# EAGLE design Nixie_power_supply_v1.0.2 (EAGLE 6.5.0)
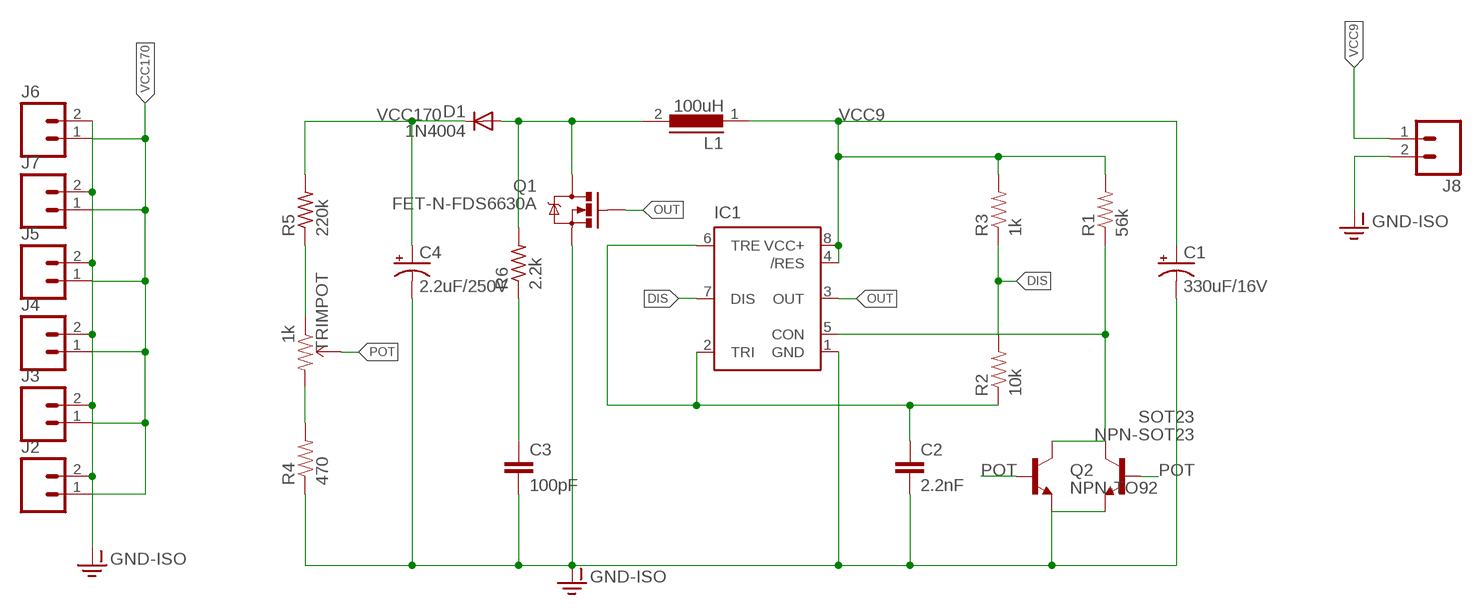
[diagram p0: schematic, sheet 1]

## Parts
C1  330uF/16V  CPOL-USE3.5-8  [E3,5-8]
C2  2.2nF  CAP0805  [0805]
C3  100pF  C-EUC1005  [C1005]
C4  2.2uF/250V  CAP_POLPTH1  [CPOL-RADIAL-100UF-25V]
D1  1N4004  [DO41-10]
IC1  NE555D  [SO08]
J2  M02LOCK  [1X02_LOCK]
J3  M02LOCK  [1X02_LOCK]
J4  M02LOCK  [1X02_LOCK]
J5  M02LOCK  [1X02_LOCK]
J6  M02LOCK  [1X02_LOCK]
J7  M02LOCK  [1X02_LOCK]
J8  M02LOCK  [1X02_LOCK]
L1  100uH  DR74  [DR74]
Q1  FET-N-FDS6630A  MOSFET-NCHANNELFDS6630A  [SO08]
Q2  NPN-TO92  TRANSISTOR_NPNBC547  [TO-92-AMMO]
R1  56k  RESISTOR0805-RES  [0805]
R2  10k  RESISTOR0805-RES  [0805]
R3  1k  RESISTOR0805-RES  [0805]
R4  470  RESISTOR0805-RES  [0805]
R5  220k  R-US_R1206  [R1206]
R6  2.2k  R-US_R1206  [R1206]
SOT23  NPN-SOT23  BC817-16-NPN-SOT23-BEC  [SOT23-BEC]
TRIMPOT  1k  TRIMPOT-2  [TRIMPOT_TC33]

## Nets
C2: C2.1 IC1.2(TRI) IC1.6(TRE) R2.1
DIS: IC1.7(DIS) R2.2 R3.1
GND-ISO: C1.- C2.2 C3.2 C4.2(-) IC1.1(GND) J2.2 J3.2 J4.2 J5.2 J6.2 J7.2 J8.2 Q1.1(S) Q1.2(S) Q1.3(S) Q2.3(E) R4.1 SOT23.E
N$1: D1.A L1.2 Q1.5(D) Q1.6(D) Q1.7(D) Q1.8(D) R6.2
N$4: C3.1 R6.1
N$6: R5.1 TRIMPOT.1(CCW)
N$7: R4.2 TRIMPOT.3(CW)
N$11: IC1.5(CON) Q2.1(C) R1.1 SOT23.C
OUT: IC1.3(OUT) Q1.4(G)
POT: Q2.2(B) SOT23.B TRIMPOT.2(WIPER)
VCC9: C1.+ IC1.4(/RES) IC1.8(VCC+) J8.1 L1.1 R1.2 R3.2
VCC170: C4.1(+) D1.C J2.1 J3.1 J4.1 J5.1 J6.1 J7.1 R5.2

## Library data of the parts
C1 = resistor:CPOL-US: POLARIZED CAPACITOR, American symbol
C2 = SparkFun-Passives:CAP: Capacitor Standard 0603 ceramic capacitor, and 0.1" leaded capacitor.
C3 = resistor:C-EU: CAPACITOR, European symbol
C4 = SparkFun-Passives:CAP_POL: Capacitor Polarized These are standard SMD and PTH capacitors. Normally 10uF, 47uF, and 100uF in electrolytic and tantalum varieties. Always verify the external diameter of the through hole cap, it varies with capacity, voltage, and manufacturer. The EIA devices should be standard.
D1 = diode:1N4004: DIODE general purpose rectifier, 1 A
IC1 = SparkFun-AnalogIC:NE555: General purpose bipolar Timer
J2-J8 = SparkFun-Connectors:M02: Standard 2-pin 0.1" header. Use with - straight break away headers ( PRT-00116) - right angle break away headers (PRT-00553) - swiss pins (PRT-00743) - machine pins (PRT-00117) - female headers (PRT-00115) Molex polarized connector foot print use with: PRT-08233 with associated crimp pins and housings. 2.54_SCREWTERM for use with PRT-10571. 3.5mm Screw Terminal footprints for PRT-08084 5mm Screw Terminal footprints for use with PRT-08432
L1 = inductors:DR74: High Power Density, High Efficiency, Shielded Inductors Source: coiltronics_dr_series.pdf
Q1 = SparkFun-DiscreteSemi:MOSFET-NCHANNEL: Common NMOSFET Parts MFG P/N Store ID Prod ID FDD8780 TRANS-09984 SI7820DN TRANS-11055 FDS6630A IC-08089 2N7002PW TRANS-11151 FQP30N06L COM-10213 TRANS-10060 BSS123LT1G TRANS-08345 BSS138 TRANS-00830 BS170 2N7000; PROD_ID: IC-08089
Q2 = SparkFun-DiscreteSemi:TRANSISTOR_NPN: Generic NPN BJT MMBT2222A - TRANS-08049 (SOT-23, 1A 40V) MPSA42 - TRANS-09116 (SOT-23, 500mA 300V) MMBT5088LT1G - TRANS-11160 (SOT-23, 50 mA 30V) BC547 - COM-08928 <http://www.sparkfun.com/products/8928> (TO-92 45V 100mA) (1.Collector 2.Base 3.Emitter) 2N3904 - COM-00521 <http://www.sparkfun.com/products/521> (TO-92 40V 200mA) (1.Emitter 2.Base 3.Collector) P2N2222A - COM-12852 <http://www.sparkfun.com/products/12852> (TO-92 40V 600mA) (1.Collector 2.Base 3.Emitter)
R1-R4 = SparkFun-Passives:RESISTOR: Resistor Basic schematic elements and footprints for 0603, 1206, and PTH resistors.
R5 R6 = rcl:R-US_: RESISTOR, American symbol
SOT23 = transistor:*-NPN-: NPN Transistror BF959 corrected 2008.03.06
TRIMPOT = SparkFun-Electromechanical:TRIMPOT: Various small potentiometers for "set-and-forget" applications

## Board
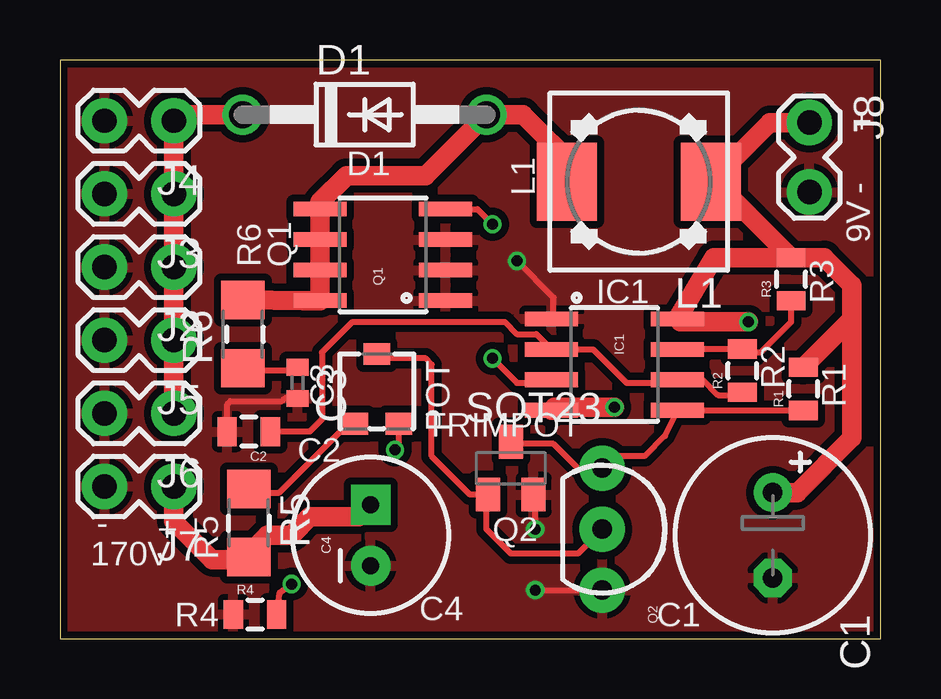
[diagram p1: board, top side]
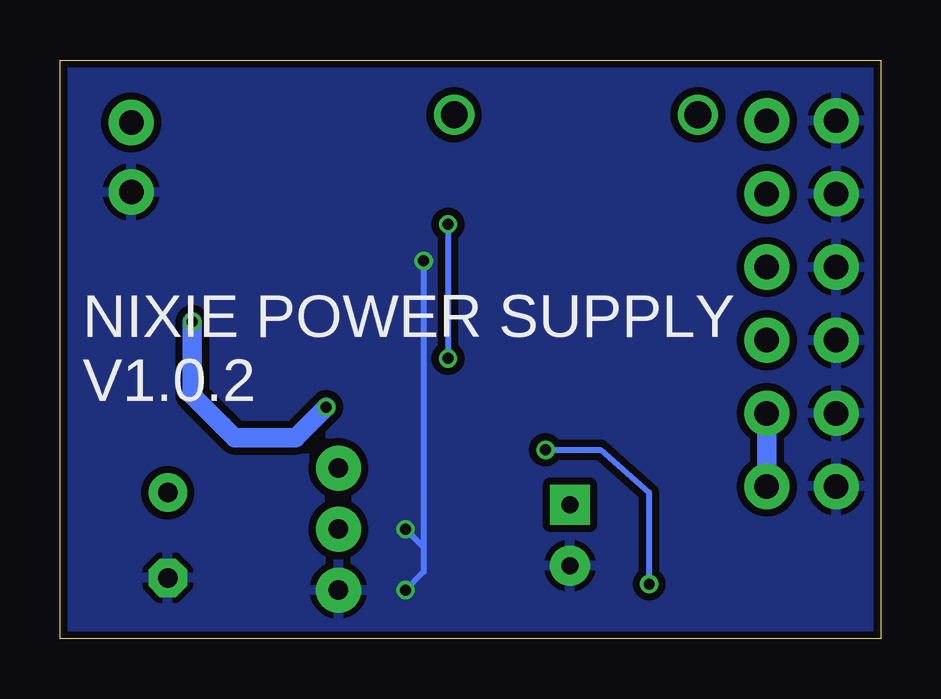
[diagram p2: board, bottom side, seen from below]

Size 34.21 x 24.12 mm. Coordinates in mm from the lower left corner, seen from the top.
Outline: 0,0 34.21,0 34.21,24.12 0,24.12 0,0
Copper layers (1*16): Top 0.035mm / dielectric 1.5mm / Bottom 0.035mm
Design rules "SeeedStudio_2layer_DRU_no_angle_20140221": minimum track width 6mil, minimum drill 12mil, track to track 6mil, track to pad 6mil, pad to pad 6mil, via to via 6mil, smd to smd 0mil, copper to edge 10mil, drill to drill 10mil, minimum pad ring 10mil, minimum via ring 6mil, stop-mask expansion 2mil, vias tented up to drill 100mil, thermal gap 10mil

### Footprints (pad centres in the part's own frame; a part is rotated, then mirrored left to right if it is on the bottom)
E3,5-8 = drill 0.813 pad 1.6: + -1.778,0 | drill 0.813 pad 1.6 octagon: - 1.778,0
0805 = smd 0.8 x 1.2: 1 -0.9,0; 2 0.9,0
C1005 = smd 0.7 x 0.9: 1 -0.65,0; 2 0.65,0
CPOL-RADIAL-100UF-25V = drill 0.7 pad 1.651 square: 1 1.27,0 | drill 0.7 pad 1.651: 2 -1.27,0
DO41-10 = drill 1.118: A 5.08,0; C -5.08,0
SO08 = smd 0.61 x 2.21: 1 -1.905,-2.616; 2 -0.635,-2.616; 3 0.635,-2.616; 4 1.905,-2.616; 5 1.905,2.616; 6 0.635,2.616; 7 -0.635,2.616; 8 -1.905,2.616
1X02_LOCK = drill 1.016 pad 1.88: 1 -0.178,0; 2 2.718,0
DR74 = smd 2.5 x 3.25: 1 -3,0; 2 3,0
TO-92-AMMO = drill 0.813 pad 1.88: 1 -2.54,0; 2 0,0; 3 2.54,0
R1206 = smd 1.6 x 1.803: 1 -1.422,0; 2 1.422,0
SOT23-BEC = smd 1 x 1.4: B -0.95,-1.1; C 0,1.1; E 0.95,-1.1
TRIMPOT_TC33 = smd 1.1 x 0.9: 1 -0.91,-1.45; 2 0,1.45; 3 0.91,-1.45

### Placement (x,y rotation side)
C1  29.72,4.32 270 top
C2  7.87,8.64 180 top
C3  9.91,10.67 270 top
C4  12.95,4.32 90 top
D1  12.7,21.84 0 top
IC1  23.11,11.43 270 top
J2  4.57,15.49 180 top
J3  4.57,18.54 180 top
J4  4.57,21.59 180 top
J5  4.57,12.45 180 top
J6  4.57,9.4 180 top
J7  4.57,6.35 180 top
J8  31.24,21.34 270 top
L1  24.13,19.05 180 top
Q1  13.46,16 90 top
Q2  22.61,4.57 270 top
R1  30.99,10.41 90 top
R2  28.45,11.18 90 top
R3  30.48,14.99 90 top
R4  8.13,1.02 0 top
R5  7.87,4.83 270 top
R6  7.62,12.7 90 top
SOT23  18.8,7.11 0 top
TRIMPOT  13.21,10.41 0 top

### Tracks (layer width: path | path; a pad name or v marks a point on that pad's centre or on a via)
C2
  Top 0.254: C2.1 10.41,8.64 10.92,9.14 10.92,11.94 12.19,13.21 18.54,13.21 19.05,12.7 19.86,12.7 IC1.2 22.23,12.06 23.62,10.67 25.6,10.67 IC1.6 26.8,10.79 27.43,10.16 28.33,10.16 R2.1
DIS
  Top 0.254: R3.1 30.48,13.21 29.21,11.94 28.59,11.94 R2.2 25.74,12.08 IC1.7
GND-ISO  (via drill 0.46)
  Top 0.254: C3.2 9.37,10.02 9.26,9.91 7.11,9.91 6.97,9.77 C2.2 | IC1.1 20.57,13.34 20.57,14.22 v19.05,15.75 | v19.81,2.03 Q2.3 | SOT23.E 19.81,6.01 v19.81,4.57
  Bottom 0.254: v19.05,15.75 19.05,3.81 | 19.05,3.81 19.05,2.79 v19.81,2.03 | v19.81,4.57 19.05,3.81
  pour Bottom (isolate 0.305): 0,24.13 34.29,24.13 34.29,0 0,0
  pour Top (isolate 0.305): 0,24.13 34.29,24.13 34.29,0 0,0
N$1
  Top 0.813: R6.2 10.15,14.1 Q1.8 Q1.7 Q1.6 Q1.5 10.85,18.21 11.94,19.3 15.24,19.3 D1.A 19.3,21.84 21.59,19.56 21.59,19.51 L1.2 20.57,19.05
N$4
  Top 0.254: C3.1 9.76,11.18 7.62,11.18 R6.1
N$6
  Top 0.254: R5.1 8.27,6.1 9.14,6.1 12.01,8.96 TRIMPOT.1
N$7  (via drill 0.46)
  Top 0.254: TRIMPOT.3 14.12,8.02 v13.97,7.87 | v9.65,2.29 9.14,1.89 R4.2
  Bottom 0.254: v13.97,7.87 11.68,7.87 9.65,6.1 v9.65,2.29
N$11
  Top 0.254: R1.1 25.74,9.51 IC1.5 25.22,8.46 24.38,7.62 23.11,7.62 Q2.1 21.59,7.11 20.57,8.13 18.88,8.13 SOT23.C
OUT  (via drill 0.46)
  Top 0.254: Q1.4 17.4,17.91 v18.03,17.27 | v18.03,11.68 19.05,10.67 20.37,10.67 IC1.3
  Bottom 0.254: v18.03,17.27 v18.03,11.68
POT
  Top 0.254: SOT23.B 17.1,6.01 15.49,7.62 15.49,11.43 15.24,11.68 13.39,11.68 TRIMPOT.2 | Q2.2 21.59,3.56 18.8,3.56 17.78,4.57 17.78,5.95 SOT23.B | SOT23.B 17.85,6.03 17.78,6.1
VCC9  (via drill 0.46)
  Top 0.813: J8.1 29.59,21.51 L1.1 | L1.1 27.43,19.05 | R3.2 30.29,15.89 27.27,15.89 IC1.8 25.86,13.21 v28.7,13.21 | L1.1 27.32,19.05 R3.2 | C1.+ 30.73,6.1 33.02,8.38 33.02,13.21 32.95,13.28 | R3.2 31.87,15.89 33.02,14.73 33.02,13.35 32.95,13.28 | 32.95,13.28 R1.2 | v23.11,9.65 20.62,9.65 IC1.4
  Bottom 0.813: v28.7,13.21 28.7,10.16 27.43,8.89 26.92,8.38 24.38,8.38 v23.11,9.65
VCC170
  Top 0.813: D1.C 5,21.84 J4.1 J3.1 J2.1 J5.1 J6.1 | J7.1 4.75,4.9 6.35,3.3 7.77,3.3 R5.2 7.87,3.56 8.64,4.32 9.65,4.32 10.41,5.08 12.45,5.08 C4.1
  Bottom 0.813: J6.1 J7.1

### Text on the board
_tplace: + | L1 | D1 | - | 9V | R6 | Q1 | IC1 | R3 | C3 | R2 | R1 | POT | C2 | - | + | Q2 | 170V | R5 | R4 | C4 | C1
_bplace: NIXIE POWER SUPPLY / V1.0.2